# EAGLE design BP.LCDadapter.v3 (EAGLE 5.11)
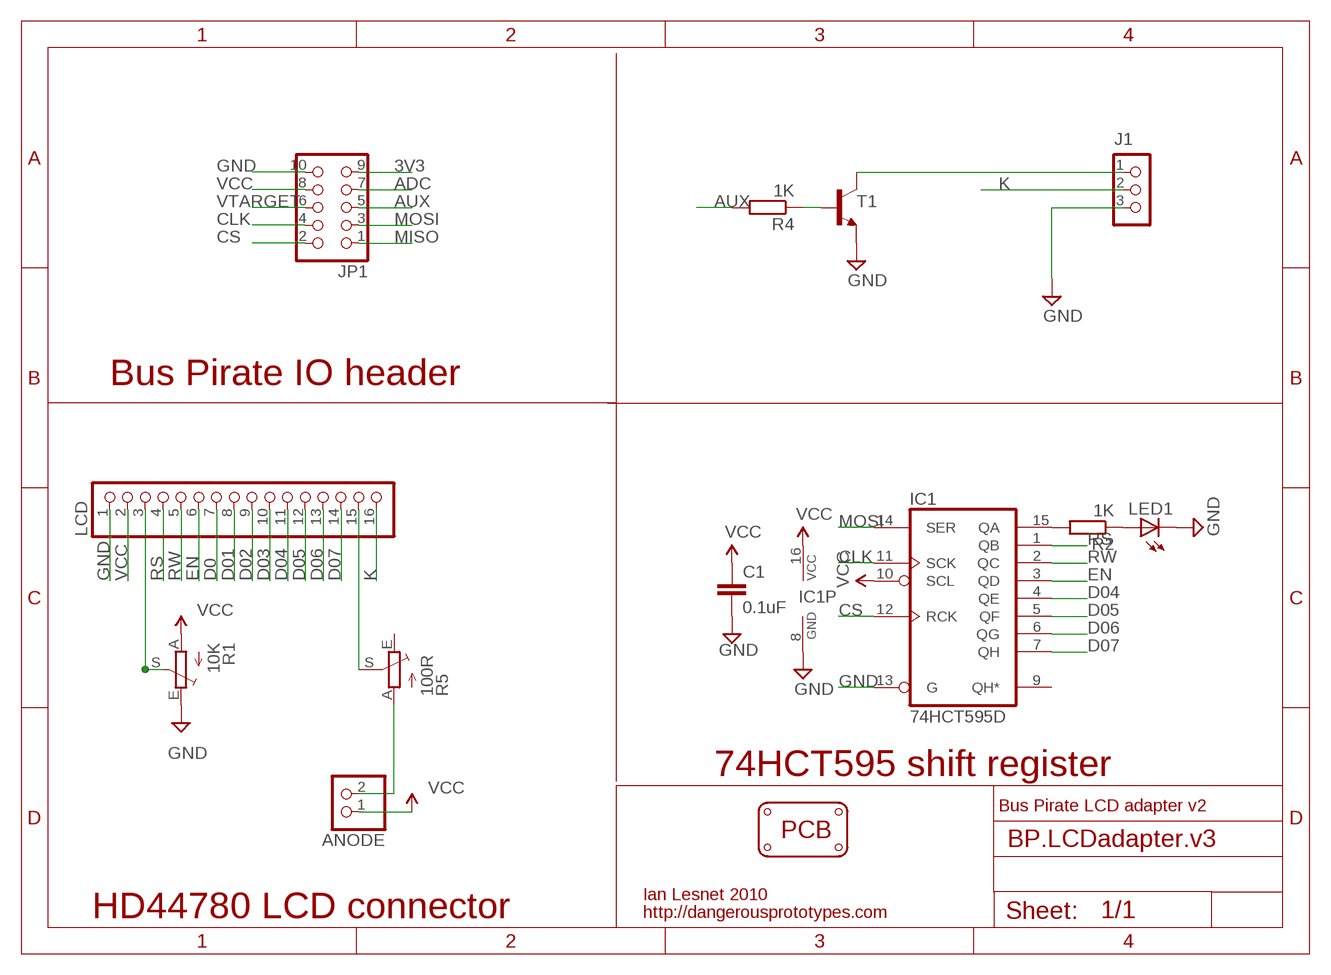
[diagram p0: schematic, sheet 1]

## Parts
ANODE  PINHD-1X2  [1X02]
C1  0.1uF  C-EUC0805  [C0805]
IC1  74HCT595D  74HC595D  [SO16]
J1  CON_HEADER_1X03-PTH  [M1X3]
JP1  CON_HEADER_2X05-PTH+SHROUDED_A  [PINSHRD_PTH_2X05]
LCD  PINHD-1X16  [1X16]
LED1  LEDCHIP-LED0805  [CHIP-LED0805]
PCB1  PCB_DP_RECTANGLE-37X60  [DP6037_V1]
R1  10K  TRIM_EU-CA6V  [CA6V]
R2  1K  R-EU_M0805  [M0805]
R4  1K  R-EU_M0805  [M0805]
R5  100R  TRIM_EU-CA6V  [CA6V]
T1  NPNSOT23BEC  [SOT23-BEC]

## Nets
3V3: JP1.9
ADC: JP1.7
AUX: JP1.5 R4.2
CLK: IC1.11(SCK) JP1.4
CS: IC1.12(RCK) JP1.2
D0: LCD.7
D01: LCD.8
D02: LCD.9
D03: LCD.10
D04: IC1.4(QE) LCD.11
D05: IC1.5(QF) LCD.12
D06: IC1.6(QG) LCD.13
D07: IC1.7(QH) LCD.14
EN: IC1.3(QD) LCD.6
GND: C1.2 IC1.8(GND) IC1.13(G) J1.3 JP1.10 LCD.1 LED1.C R1.E T1.E
K: J1.2 LCD.16
MISO: JP1.1
MOSI: IC1.14(SER) JP1.3
N$1: IC1.15(QA) R2.2
N$2: LED1.A R2.1
N$3: ANODE.2 R5.A
N$4: LCD.15 R5.S
N$6: J1.1 T1.C
N$7: LCD.3 R1.S
N$8: R4.1 T1.B
RS: IC1.1(QB) LCD.4
RW: IC1.2(QC) LCD.5
VCC: ANODE.1 C1.1 IC1.10(SCL) IC1.16(VCC) JP1.8 LCD.2 R1.A
VTARGET: JP1.6
Unconnected: IC1.9(QH*) R5.E

## Notes on the sheet
- Bus Pirate IO header
- 74HCT595 shift register
- Bus Pirate LCD adapter v2
- Ian Lesnet 2010
- HD44780 LCD connector | http://dangerousprototypes.com

## Library data of the parts
ANODE = pinhead - Copy:PINHD-1X2: PIN HEADER
C1 = rcl:C-EU: CAPACITOR, European symbol
IC1 = 74xx-eu:74*595: 8-bit SHIFT REGISTER, output latch
J1 = DP:CON_HEADER_1X03
JP1 = DP:CON_HEADER_2X05: 2x05 pin header
LCD = pinhead:PINHD-1X16: PIN HEADER
LED1 = led:LED: LED OSRAM: - CHIPLED LG R971, LG N971, LY N971, LG Q971, LY Q971, LO R971, LY R971 LH N974, LH R974 LS Q976, LO Q976, LY Q976 LO Q996 - Hyper CHIPLED LW Q18S LB Q993, LB Q99A, LB R99A - SideLED LS A670, LO A670, LY A670, LG A670, LP A670 LB A673, LV A673, LT A673, LW A673 LH A674 LY A675 LS A676, LA A676, LO A676, LY A676, LW A676 LS A679, LY A679, LG A679 - Hyper Micro SIDELED® LS Y876, LA Y876, LO Y876, LY Y876 LT Y87S - SmartLED LW L88C, LW L88S LB L89C, LB L89S, LG L890 LS L89K, LO L89K, LY L89K LS L896, LA L896, LO L896, LY L896 - TOPLED LS T670, LO T670, LY T670, LG T670, LP T670 LSG T670, LSP T670, LSY T670, LOP T670, LYG T670 LG T671, LOG T671, LSG T671 LB T673, LV T673, LT T673, LW T673 LH T674 LS T676, LA T676, LO T676, LY T676, LB T676, LH T676, LSB T676, LW T676 LB T67C, LV T67C, LT T67C, LS T67K, LO T67K, LY T67K, LW E67C LS E67B, LA E67B, LO E67B, LY E67B, LB E67C, LV E67C, LT E67C LW T67C LS T679, LY T679, LG T679 LS T770, LO T770, LY T770, LG T770, LP T770 LB T773, LV T773, LT T773, LW T773 LH T774 LS E675, LA E675, LY E675, LS T675 LS T776, LA T776, LO T776, LY T776, LB T776 LHGB T686 LT T68C, LB T68C - Hyper Mini TOPLED® LB M676 - Mini TOPLED Santana® LG M470 LS M47K, LO M47K, LY M47K Source: http://www.osram.convergy.de LUXEON: - LUMILED® LXK2-PW12-R00, LXK2-PW12-S00, LXK2-PW14-U00, LXK2-PW14-V00 LXK2-PM12-R00, LXK2-PM12-S00, LXK2-PM14-U00 LXK2-PE12-Q00, LXK2-PE12-R00, LXK2-PE12-S00, LXK2-PE14-T00, LXK2-PE14-U00 LXK2-PB12-K00, LXK2-PB12-L00, LXK2-PB12-M00, LXK2-PB14-N00, LXK2-PB14-P00, LXK2-PB14-Q00 LXK2-PR12-L00, LXK2-PR12-M00, LXK2-PR14-Q00, LXK2-PR14-R00 LXK2-PD12-Q00, LXK2-PD12-R00, LXK2-PD12-S00 LXK2-PH12-R00, LXK2-PH12-S00 LXK2-PL12-P00, LXK2-PL12-Q00, LXK2-PL12-R00 Source: www.luxeon.com KINGBRIGHT: KA-3528ASYC Source: www.kingbright.com
PCB1 = PCBStandards:PCB_DP_RECTANGLE: Dangerous Prototypes Standard Rectangular PCB sizes
R1 R5 = pot:TRIM_EU-: POTENTIOMETER
R2 R4 = rcl:R-EU_: RESISTOR, European symbol
T1 = dp_devices:NPN: Most commonly used is SOT23-BEC

## Board
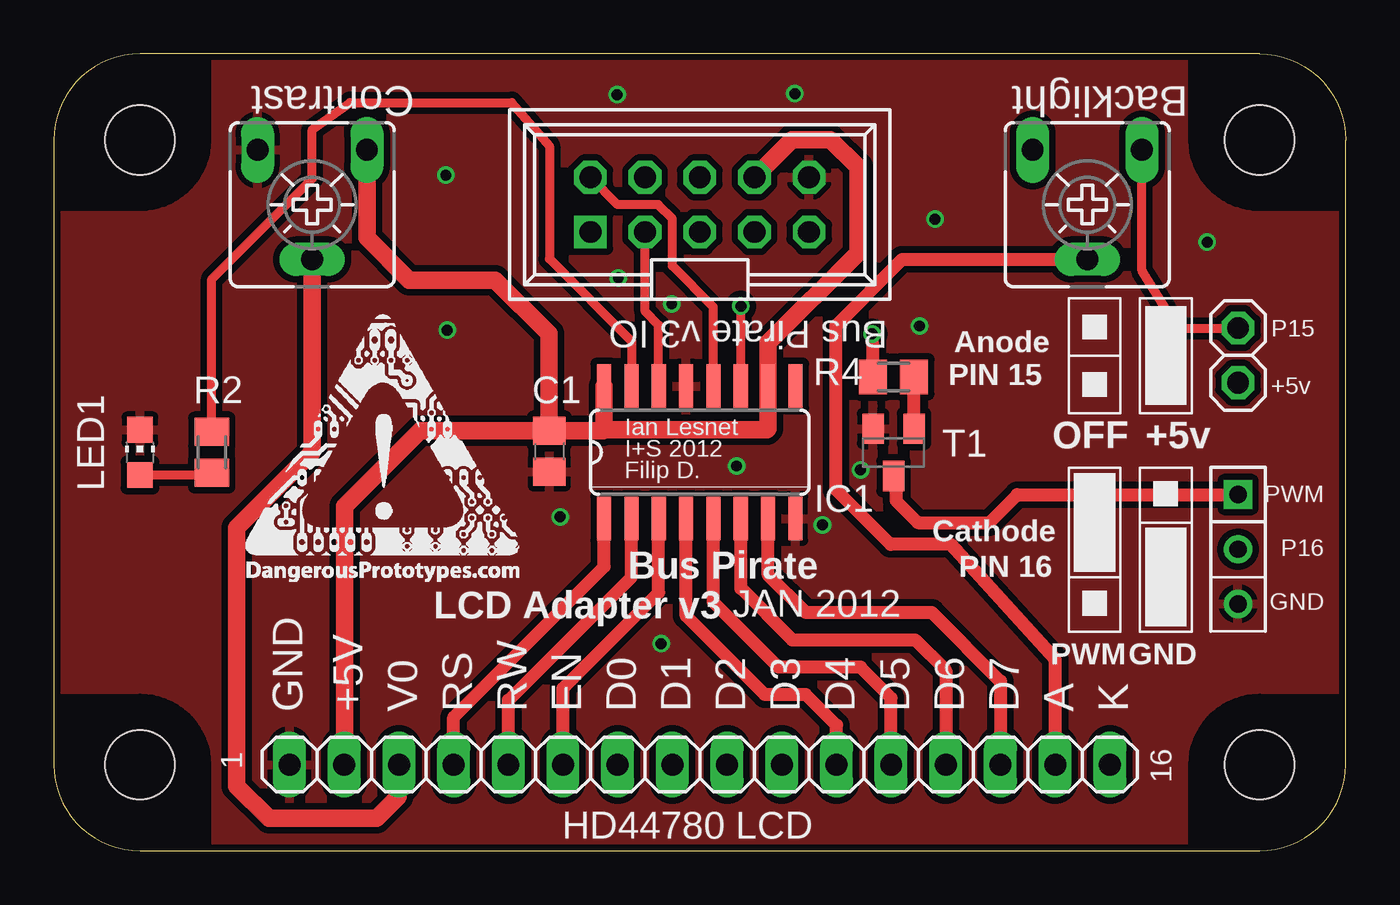
[diagram p1: board, top side]
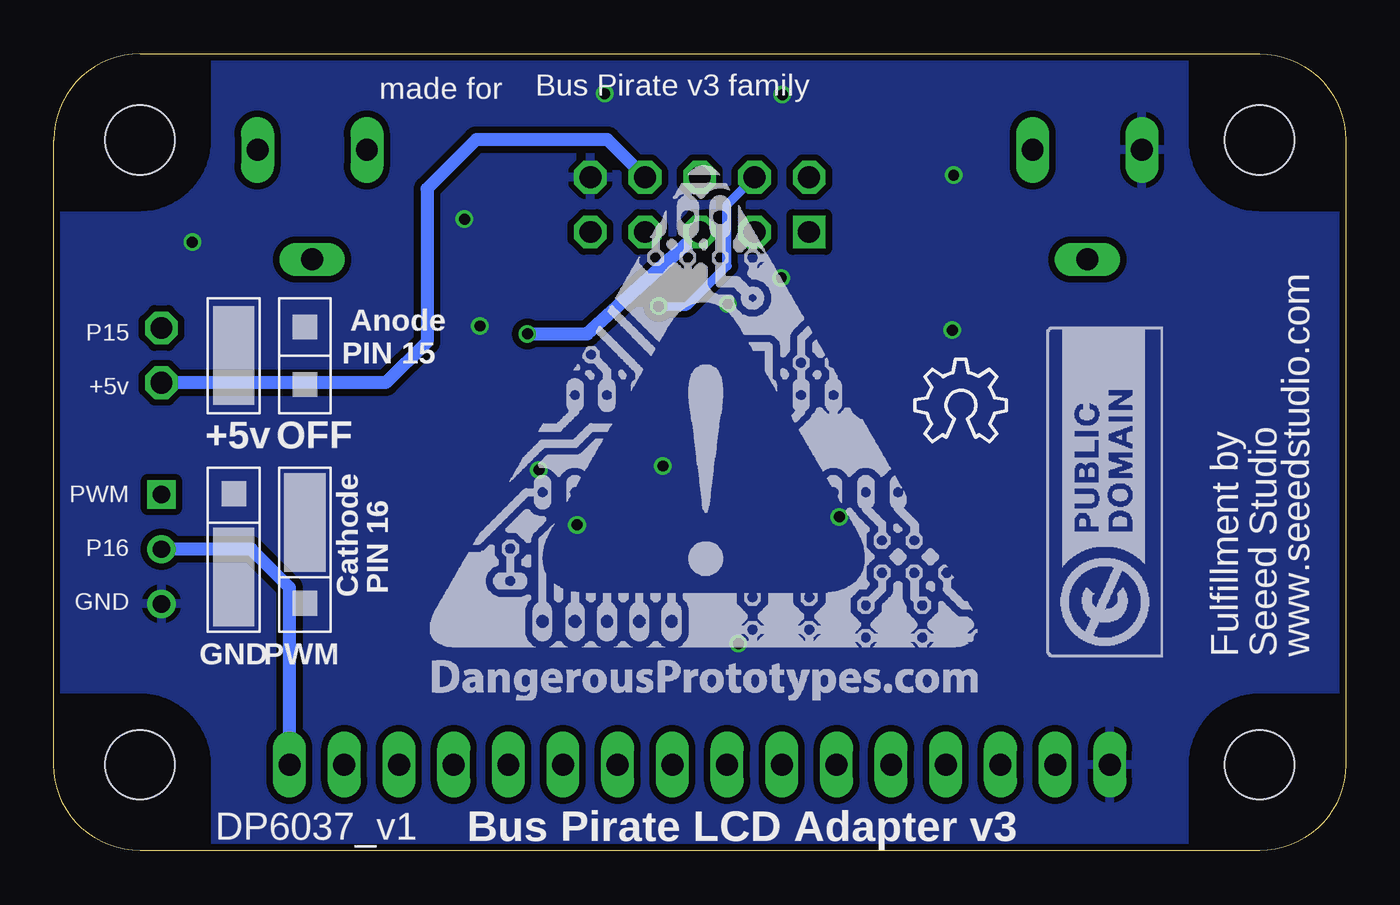
[diagram p2: board, bottom side, seen from below]

Size 60 x 37 mm. Coordinates in mm from the lower left corner, seen from the top.
Copper layers (1*16): Top 0.035mm / dielectric 1.5mm / Bottom 0.035mm
Design rules "Fusion_eagle_rule_v1.1": minimum track width 6mil, minimum drill 12mil, track to track 6mil, track to pad 6mil, pad to pad 6mil, via to via 6mil, smd to smd 0mil, copper to edge 10mil, drill to drill 10mil, minimum pad ring 10mil, minimum via ring 6mil, stop-mask expansion 2mil, vias tented up to drill 100mil, thermal gap 10mil

### Footprints (pad centres in the part's own frame; a part is rotated, then mirrored left to right if it is on the bottom)
1X02 = drill 1.016 octagon: 1 -1.27,0; 2 1.27,0
C0805 = smd 1.3 x 1.5: 1 -0.95,0; 2 0.95,0
SO16 = smd 0.66 x 2.032: 1 -4.445,-3.073; 2 -3.175,-3.073; 3 -1.905,-3.073; 4 -0.635,-3.073; 5 0.635,-3.073; 6 1.905,-3.073; 7 3.175,-3.073; 8 4.445,-3.073; 9 4.445,3.073; 10 3.175,3.073; 11 1.905,3.073; 12 0.635,3.073; 13 -0.635,3.073; 14 -1.905,3.073; 15 -3.175,3.073; 16 -4.445,3.073
M1X3 = drill 0.8 square: 1 0,0 | drill 0.8 round: 2 2.54,0; 3 5.08,0
PINSHRD_PTH_2X05 = drill 1.016 square: 1 -5.08,-1.27 | drill 1.016 octagon: 2 -5.08,1.27; 3 -2.54,-1.27; 4 -2.54,1.27; 5 0,-1.27; 6 0,1.27; 7 2.54,-1.27; 8 2.54,1.27; 9 5.08,-1.27; 10 5.08,1.27
1X16 = drill 1.016 long: 1 -19.05,0; 2 -16.51,0; 3 -13.97,0; 4 -11.43,0; 5 -8.89,0; 6 -6.35,0; 7 -3.81,0; 8 -1.27,0; 9 1.27,0; 10 3.81,0; 11 6.35,0; 12 8.89,0; 13 11.43,0; 14 13.97,0; 15 16.51,0; 16 19.05,0
CHIP-LED0805 = smd 1.2 x 1.2: A 0,-1.05; C 0,1.05
DP6037_V1 = hole 3.2: 4,4; 56,4; 56,33; 4,33
CA6V = drill 1.016 long: A -2.54,-2.54; E 2.54,-2.54; S 0,2.54
M0805 = smd 1.3 x 1.6: 1 -0.95,0; 2 0.95,0
SOT23-BEC@1 = smd 1 x 1.4: B -0.95,-1.1; C 0,1.1; E 0.95,-1.1

### Placement (x,y rotation side)
ANODE  55,23 90 top
C1  23.02,18.54 270 top
IC1  30,18.5 0 top
J1  55,16.54 270 top
JP1  30,30 0 top
LCD  30,4 0 top
LED1  4,18.5 0 top
PCB1  0,0 0 top
R1  12,30 180 top
R2  7.34,18.5 90 top
R4  39,22 180 top
R5  48,30 180 top
T1  [SOT23-BEC@1]  39,18.5 180 top
U$1  [DP_LOGO_ART_1X1]  42.5,7 0 bottom
U$2  [LOGO_CC-0]  8.5,9 90 bottom
U$3  [OSHW_6X150_NOTEXT]  20,19 0 bottom
U$4  [DP_LOGO_ART_0.5X0.5]  8.93,12.51 0 top

### Tracks (layer width: path | path; a pad name or v marks a point on that pad's centre or on a via)
AUX  (via drill 0.51)
  Top 0.61: v38,24 38.05,23.45 R4.2
  Bottom 0.61: JP1.5 35.23,24 v38,24
CLK  (via drill 0.51)
  Top 0.406: IC1.11 31.91,24.52 v31.91,25.28
  Bottom 0.406: JP1.4 28.73,30 28.73,27.15 30.6,25.28 v31.91,25.28
CS
  Top 0.406: IC1.12 30.64,25.25 28.73,27.15 28.73,29.34 28.07,30 26.19,30 JP1.2
D04
  Top 0.61: IC1.4 29.36,10.91 33.02,7.25 34.92,7.25 36.35,5.83 LCD.11
D05
  Top 0.61: IC1.5 30.64,11.54 33.66,8.53 37.47,8.53 38.89,7.1 LCD.12
D06
  Top 0.61: IC1.6 31.91,12.18 34.29,9.79 40.01,9.79 41.43,8.37 LCD.13
D07
  Top 0.61: IC1.7 33.17,12.81 34.92,11.06 40.78,11.06 43.97,7.88 LCD.14
EN
  Top 0.61: IC1.3 28.09,11.98 23.65,7.54 LCD.6
GND  (via drill 0.51)
  other vias: 37.47,17.69 23.52,15.5 28.7,25.39 40.93,29.32 40.21,24.36 53.56,28.26 31.71,17.86 35.7,15.13 18.27,24.17 18.21,31.36 26.16,35.1 26.21,26.59 28.21,9.62 34.42,35.15
  pour Bottom (isolate 0.305): 0,37 60,37 60,0 0,0
  pour Top (isolate 0.305): 0,37 60,37 60,0 0,0
K
  Bottom 0.61: LCD.16 49.05,12.22 50.83,14 J1.2
MOSI
  Top 0.406: IC1.14 28.09,24.41 27.46,25.04 JP1.3
N$1
  Top 0.406: IC1.15 26.84,21.59 26.84,23.66 23.02,27.48 23.02,32.72 21.26,34.73 13.75,34.73 12,33.48 12,31.2 7.34,26.54 R2.2
N$2
  Top 0.406: LED1.A 6.74,17.45 R2.1
N$3
  Top 0.406: R5.A 50.54,26.94 52.21,24.27 ANODE.2
N$4
  Top 0.61: R5.S 39.4,27.46 36.32,24.38 36.32,16.76 38.86,14.22 41.67,14.22 46.51,8.89 LCD.15
N$6
  Top 0.61: J1.1 44.75,16.54 43.45,15.24 40.13,15.24 39.12,16.26 39.12,17.28 T1.C
N$7
  Top 0.813: LCD.3 16,3.97 16,2.5 15,1.5 10,1.5 8.5,3 8.5,15 12,18.5 R1.S
N$8
  Top 0.61: T1.B R4.1
RS
  Top 0.61: IC1.1 25.55,13.19 18.57,6.21 LCD.4
RW
  Top 0.61: IC1.2 26.82,12.71 21.11,7 LCD.5
VCC
  Top 0.406: 33.18,19.6 33.01,19.77
  Top 0.813: IC1.10 33.18,23.59 37.34,27.75 37.34,31.75 36.07,33.02 34.29,33.02 JP1.8 | IC1.10 | IC1.10 33.18,19.6 33.12,19.55 25.55,19.55 | 25.55,19.55 IC1.16 | 25.55,19.55 25.5,19.49 C1.1 23,19.5 | 23,19.5 23,24 20.5,26.5 16.5,26.5 14.54,28.46 R1.A | 23,19.5 17,19.5 13.5,16 LCD.2
  Bottom 0.406: ANODE.1
  Bottom 0.61: ANODE.1 44.58,21.73 42.67,23.64 42.67,30.73 40.39,33.02 34.29,33.02 JP1.8

### Text on the board
tNames: Contrast | Backlight | Bus Pirate v3 IO | P15 | Anode | PIN 15 | +5v | OFF | +5v | Ian Lesnet | I+S 2012 | Filip D. | PWM | Bus Pirate | Cathode | PIN 16 | P16 | LCD Adapter v3 | GND | JAN 2012 | PWM | GND | GND | +5V | V0 | RS | RW | EN | D0 | D1 | D2 | D3 | D4 | D5 | D6 | D7 | A | K | 1 | 16 | HD44780 LCD
bNames: Bus Pirate v3 family | made for | Anode | P15 | PIN 15 | +5v | OFF | +5v | Cathode | PWM | P16 | PIN 16 | GND | PWM | GND | www.seeedstudio.com | Seeed Studio | Fulfillment by | Bus Pirate LCD Adapter v3